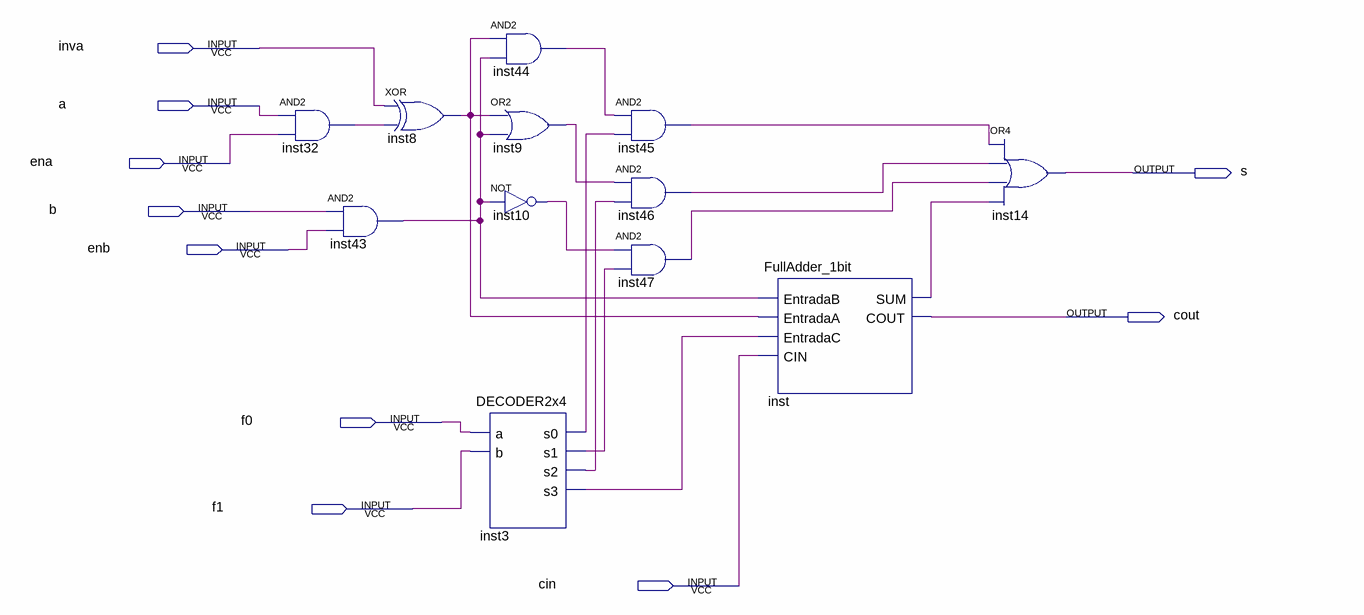
[diagram p0: schematic sheet]
// Quartus schematic ULA_1bit.bdf as structural Verilog: 12 symbols, 10 pins
module ULA_1bit (
  input  inva,
  input  a,
  input  ena,
  input  b,
  input  enb,
  input  f0,
  input  f1,
  input  cin,
  output s,
  output cout
);

  wire inst3_s0, inst3_s1, inst3_s2, inst3_s3, inst8_out, inst9_out, inst10_out, inst32_out, inst43_out,
       inst44_out, inst45_out, inst46_out, inst47_out, inst_sum;

  and inst32 (inst32_out, a, ena);
  and inst43 (inst43_out, b, enb);
  xor inst8 (inst8_out, inva, inst32_out);
  DECODER2x4 inst3 (.a(f0), .b(f1), .s0(inst3_s0), .s1(inst3_s1), .s2(inst3_s2), .s3(inst3_s3));
  and inst44 (inst44_out, inst8_out, inst43_out);
  or inst9 (inst9_out, inst8_out, inst43_out);
  not inst10 (inst10_out, inst43_out);
  and inst45 (inst45_out, inst44_out, inst3_s0);
  and inst46 (inst46_out, inst9_out, inst3_s2);
  and inst47 (inst47_out, inst10_out, inst3_s1);
  FullAdder_1bit inst (
    .EntradaB(inst43_out), .EntradaA(inst8_out), .EntradaC(inst3_s3), .CIN(cin), .SUM(inst_sum), .COUT(cout));
  or inst14 (s, inst45_out, inst46_out, inst47_out, inst_sum);
endmodule
